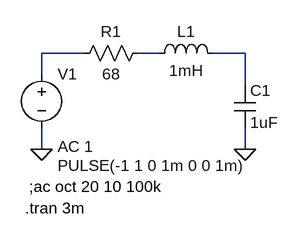
[diagram p0: schematic RLC_LPF.asc]
RLC_LPF.asc, the LTspice schematic file:
Version 4
SHEET 1 880 680
WIRE 192 80 128 80
WIRE 304 80 272 80
WIRE 432 80 384 80
WIRE 128 112 128 80
WIRE 432 128 432 80
WIRE 128 224 128 192
WIRE 432 224 432 192
FLAG 432 224 0
FLAG 128 224 0
SYMBOL voltage 128 96 R0
WINDOW 3 24 152 Left 2
WINDOW 123 24 124 Left 2
WINDOW 39 0 0 Left 2
SYMATTR InstName V1
SYMATTR Value PULSE(-1 1 0 1m 0 0 1m)
SYMATTR Value2 AC 1
SYMBOL res 288 64 R90
WINDOW 0 0 56 VBottom 2
WINDOW 3 32 56 VTop 2
SYMATTR InstName R1
SYMATTR Value 68
SYMBOL ind 288 96 R270
WINDOW 0 32 56 VTop 2
WINDOW 3 5 56 VBottom 2
SYMATTR InstName L1
SYMATTR Value 1mH
SYMBOL cap 416 128 R0
SYMATTR InstName C1
SYMATTR Value 1uF
TEXT 110 280 Left 2 !;ac oct 20 10 100k
TEXT 104 312 Left 2 !.tran 3m

The netlist it stands for:
* RLC_LPF.asc
V1 N001 0 PULSE(-1 1 0 1m 0 0 1m) AC 1
R1 N002 N001 68
L1 N002 N003 1mH
C1 N003 0 1uF
;ac oct 20 10 100k
.tran 3m
.backanno
.end